# EAGLE design ONA_SensorMoteV1 (EAGLE 6.5.0)

## Sheet 1 of 4
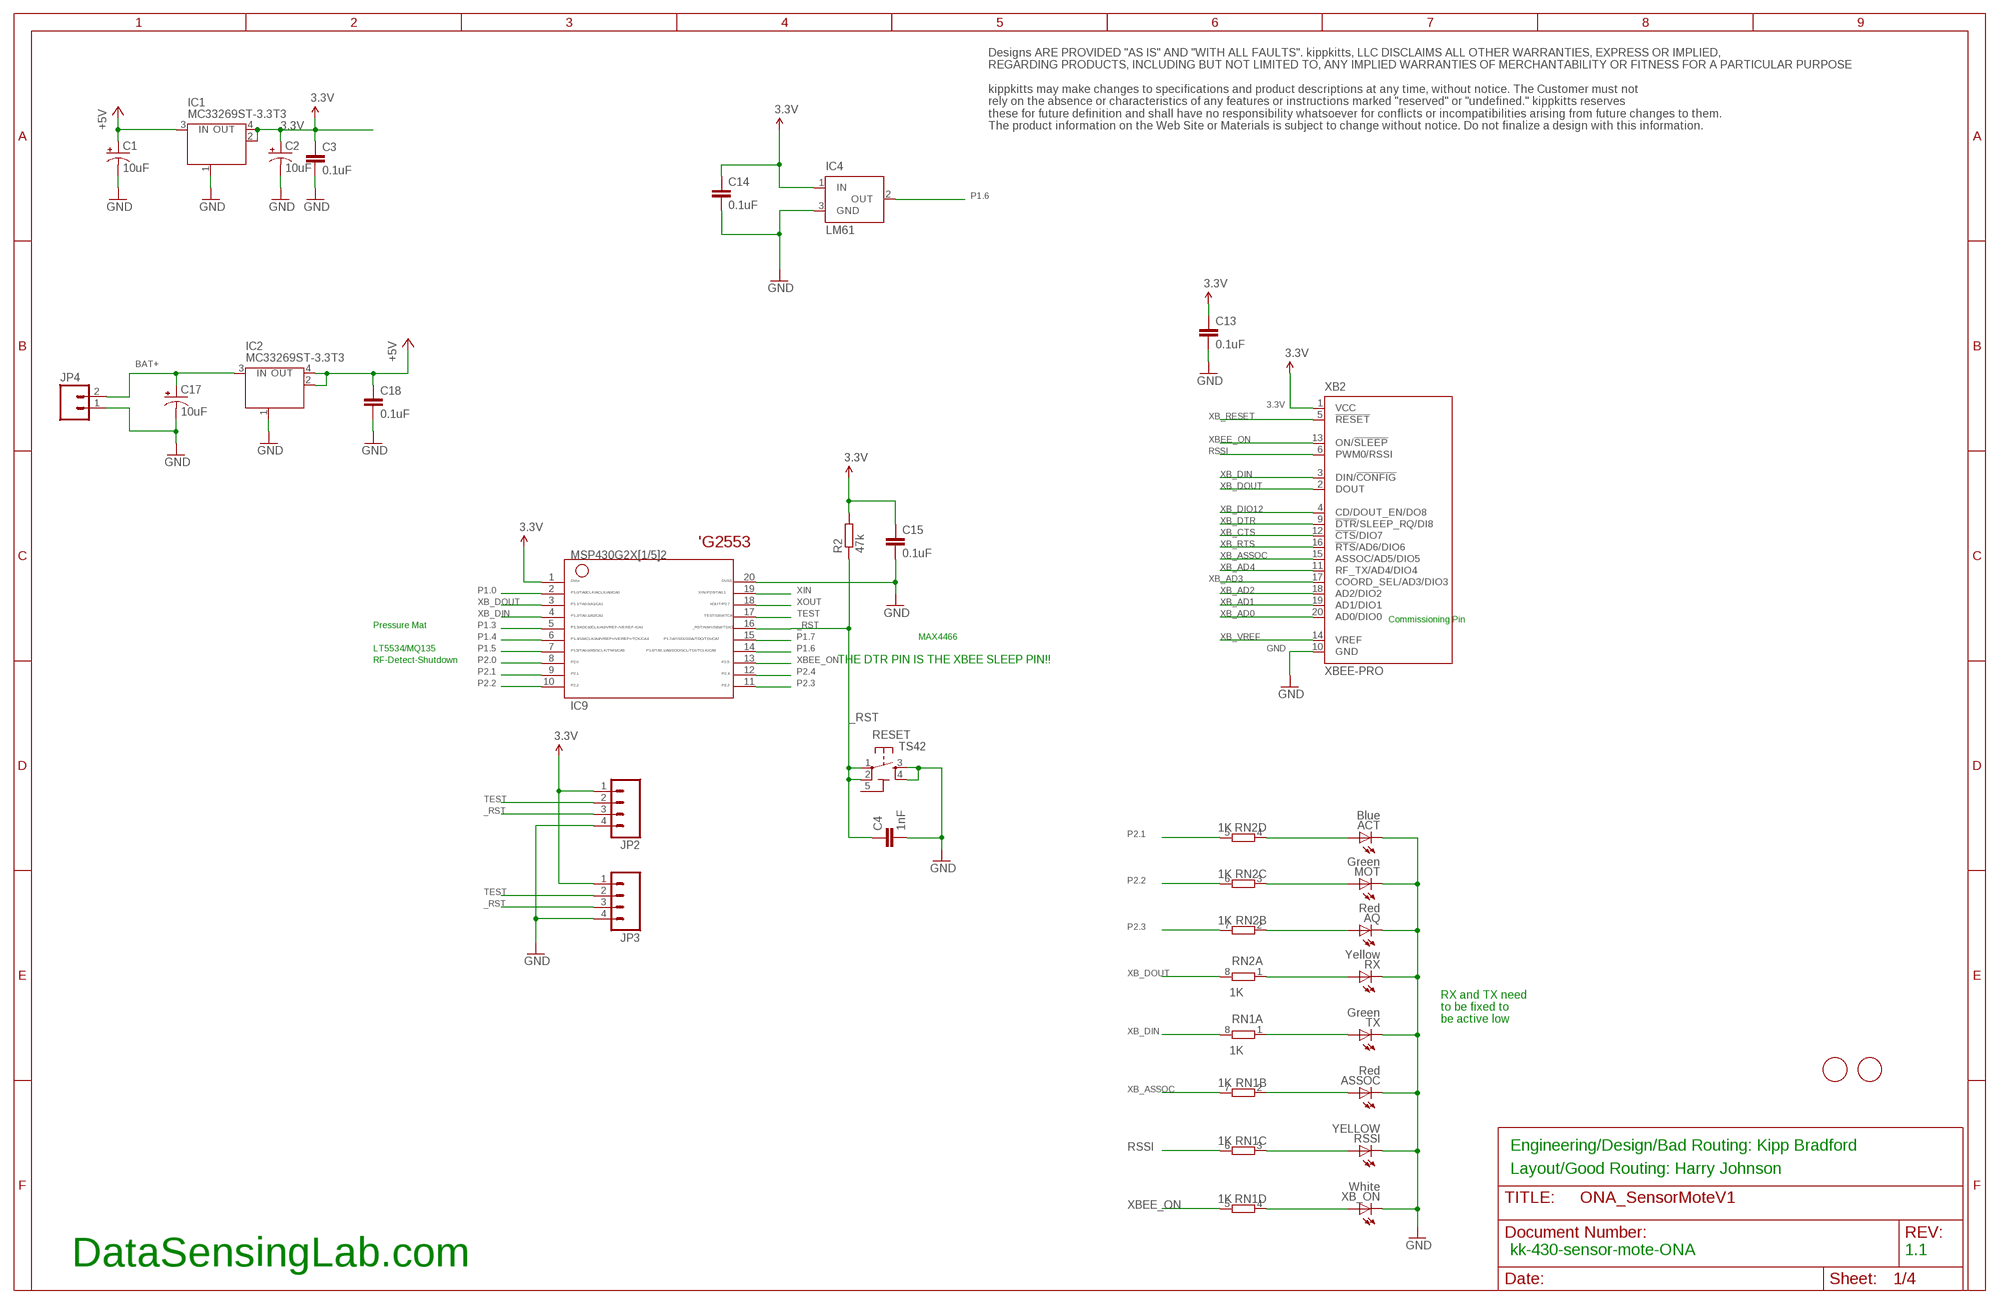
[diagram p0: schematic, sheet 1]

### Parts
A1  FIDUCIALMOUNT  [FIDUCIA-MOUNT]
A2  FIDUCIALMOUNT  [FIDUCIA-MOUNT]
ACT  Blue  LEDCHIP-LED0805  [CHIP-LED0805]
AQ  Red  LEDCHIP-LED0805  [CHIP-LED0805]
ASSOC  Red  LEDCHIP-LED0805  [CHIP-LED0805]
C1  10uF  CAP_POL1206  [EIA3216]
C2  10uF  CAP_POL1206  [EIA3216]
C3  0.1uF  C-EUC0805K  [C0805K]
C4  1nF  C-EUC0805K  [C0805K]
C13  0.1uF  C-EUC0805K  [C0805K]
C14  0.1uF  C-EUC0805K  [C0805K]
C15  0.1uF  C-EUC0805K  [C0805K]
C17  10uF  CAP_POL1206  [EIA3216]
C18  0.1uF  C-EUC0805K  [C0805K]
DISCLAIMER1  DISCLAIMERV1  [DISCLAIMER]
IC1  MC33269ST-3.3T3  [SOT223]
IC2  MC33269ST-3.3T3  [SOT223]
IC4  LM61  MAX6520  [SOT23]
IC9  G2X[1/5]2---PW20  [PW20]
JP2  M04SMD  [1X04-SMD]
JP3  M04PTH  [1X04]
JP4  M02  [1X02_LONGPADS]
MOT  Green  LEDCHIP-LED0805  [CHIP-LED0805]
R2  47k  R-EU_R0805  [R0805]
RESET  TS42  [TS42]
RN1  1K  4R-NCAY16  [CAY16]
RN2  1K  4R-NCAY16  [CAY16]
RSSI  YELLOW  LEDCHIP-LED0805  [CHIP-LED0805]
RX  Yellow  LEDCHIP-LED0805  [CHIP-LED0805]
TX  Green  LEDCHIP-LED0805  [CHIP-LED0805]
XB2  XBEE-PRO  [XBEE-PRO]
XB_ON  White  LEDCHIP-LED0805  [CHIP-LED0805]

### Nets
3.3V: C2.A(+) C3.1 C13.1 C14.1 C15.1 IC1.2(OUT) IC1.4(OUT) IC4.1(IN) IC9.1 JP2.1 JP3.1 R2.2 XB2.1(VCC) ; also sheet 2,3
+5V: C1.A(+) C18.1 IC1.3(IN) IC2.2(OUT) IC2.4(OUT) ; also sheet 3
_RST: C4.1 IC9.16 JP2.3 JP3.3 R2.1 RESET.1 RESET.2
BAT+: C17.A(+) IC2.3(IN) JP4.2
GND: ACT.C AQ.C ASSOC.C C1.C(-) C2.C(-) C3.2 C4.2 C13.2 C14.2 C15.2 C17.C(-) C18.2 IC1.1(GND/ADJ) IC2.1(GND/ADJ) IC4.3(GND) IC9.20 JP2.4 JP3.4 JP4.1 MOT.C RESET.3 RESET.4 RSSI.C RX.C TX.C XB2.10(GND) XB_ON.C ; also sheet 2,3
N$1: RN1.1 TX.A
N$4: ASSOC.A RN1.2
N$11: ACT.A RN2.4
N$15: MOT.A RN2.3
N$16: RN1.3 RSSI.A
N$18: AQ.A RN2.2
N$19: RN2.1 RX.A
N$29: RN1.4 XB_ON.A
P1.0: IC9.2
P1.3: IC9.5 ; also sheet 3
P1.4: IC9.6 ; also sheet 3
P1.5: IC9.7 ; also sheet 3
P1.6: IC4.2(OUT) IC9.14
P1.7: IC9.15 ; also sheet 2
P2.0: IC9.8 ; also sheet 3
P2.1: IC9.9 RN2.5
P2.2: IC9.10 RN2.6
P2.3: IC9.11 RN2.7 ; also sheet 3
P2.4: IC9.12
RSSI: RN1.6 XB2.6(PWM0/RSSI)
TEST: IC9.17 JP2.2 JP3.2
XB_AD0: XB2.20(AD0/DIO0)
XB_AD1: XB2.19(AD1/DIO1)
XB_AD2: XB2.18(AD2/DIO2)
XB_AD3: XB2.17(COORD_SEL/AD3/DIO3)
XB_AD4: XB2.11(RF_TX/AD4/DIO4)
XB_ASSOC: RN1.7 XB2.15(ASSOC/AD5/DIO5)
XB_CTS: XB2.12(!CTS!/DIO7)
XB_DIN: IC9.4 RN1.8 XB2.3(DIN/!CONFIG)
XB_DIO12: XB2.4(CD/DOUT_EN/DO8)
XB_DOUT: IC9.3 RN2.8 XB2.2(DOUT)
XB_DTR: XB2.9(!DTR!/SLEEP_RQ/DI8)
XB_RESET: XB2.5(!RESET)
XB_RTS: XB2.16(!RTS!/AD6/DIO6)
XB_VREF: XB2.14(VREF)
XBEE_ON: IC9.13 RN1.5 XB2.13(ON/!SLEEP)
XIN: IC9.19
XOUT: IC9.18

### Notes on the sheet
- 'G2553
- Commissioning Pin
- Pressure Mat
- MAX4466
- LT5534/MQ135
- RF-Detect-Shutdown | THE DTR PIN IS THE XBEE SLEEP PIN!!
- RX and TX need
  to be fixed to 
  be active low
- Engineering/Design/Bad Routing: Kipp Bradford
- Layout/Good Routing: Harry Johnson
- kk-430-sensor-mote-ONA | 1.1
- DataSensingLab.com

## Sheet 2 of 4: Adafruit Parts
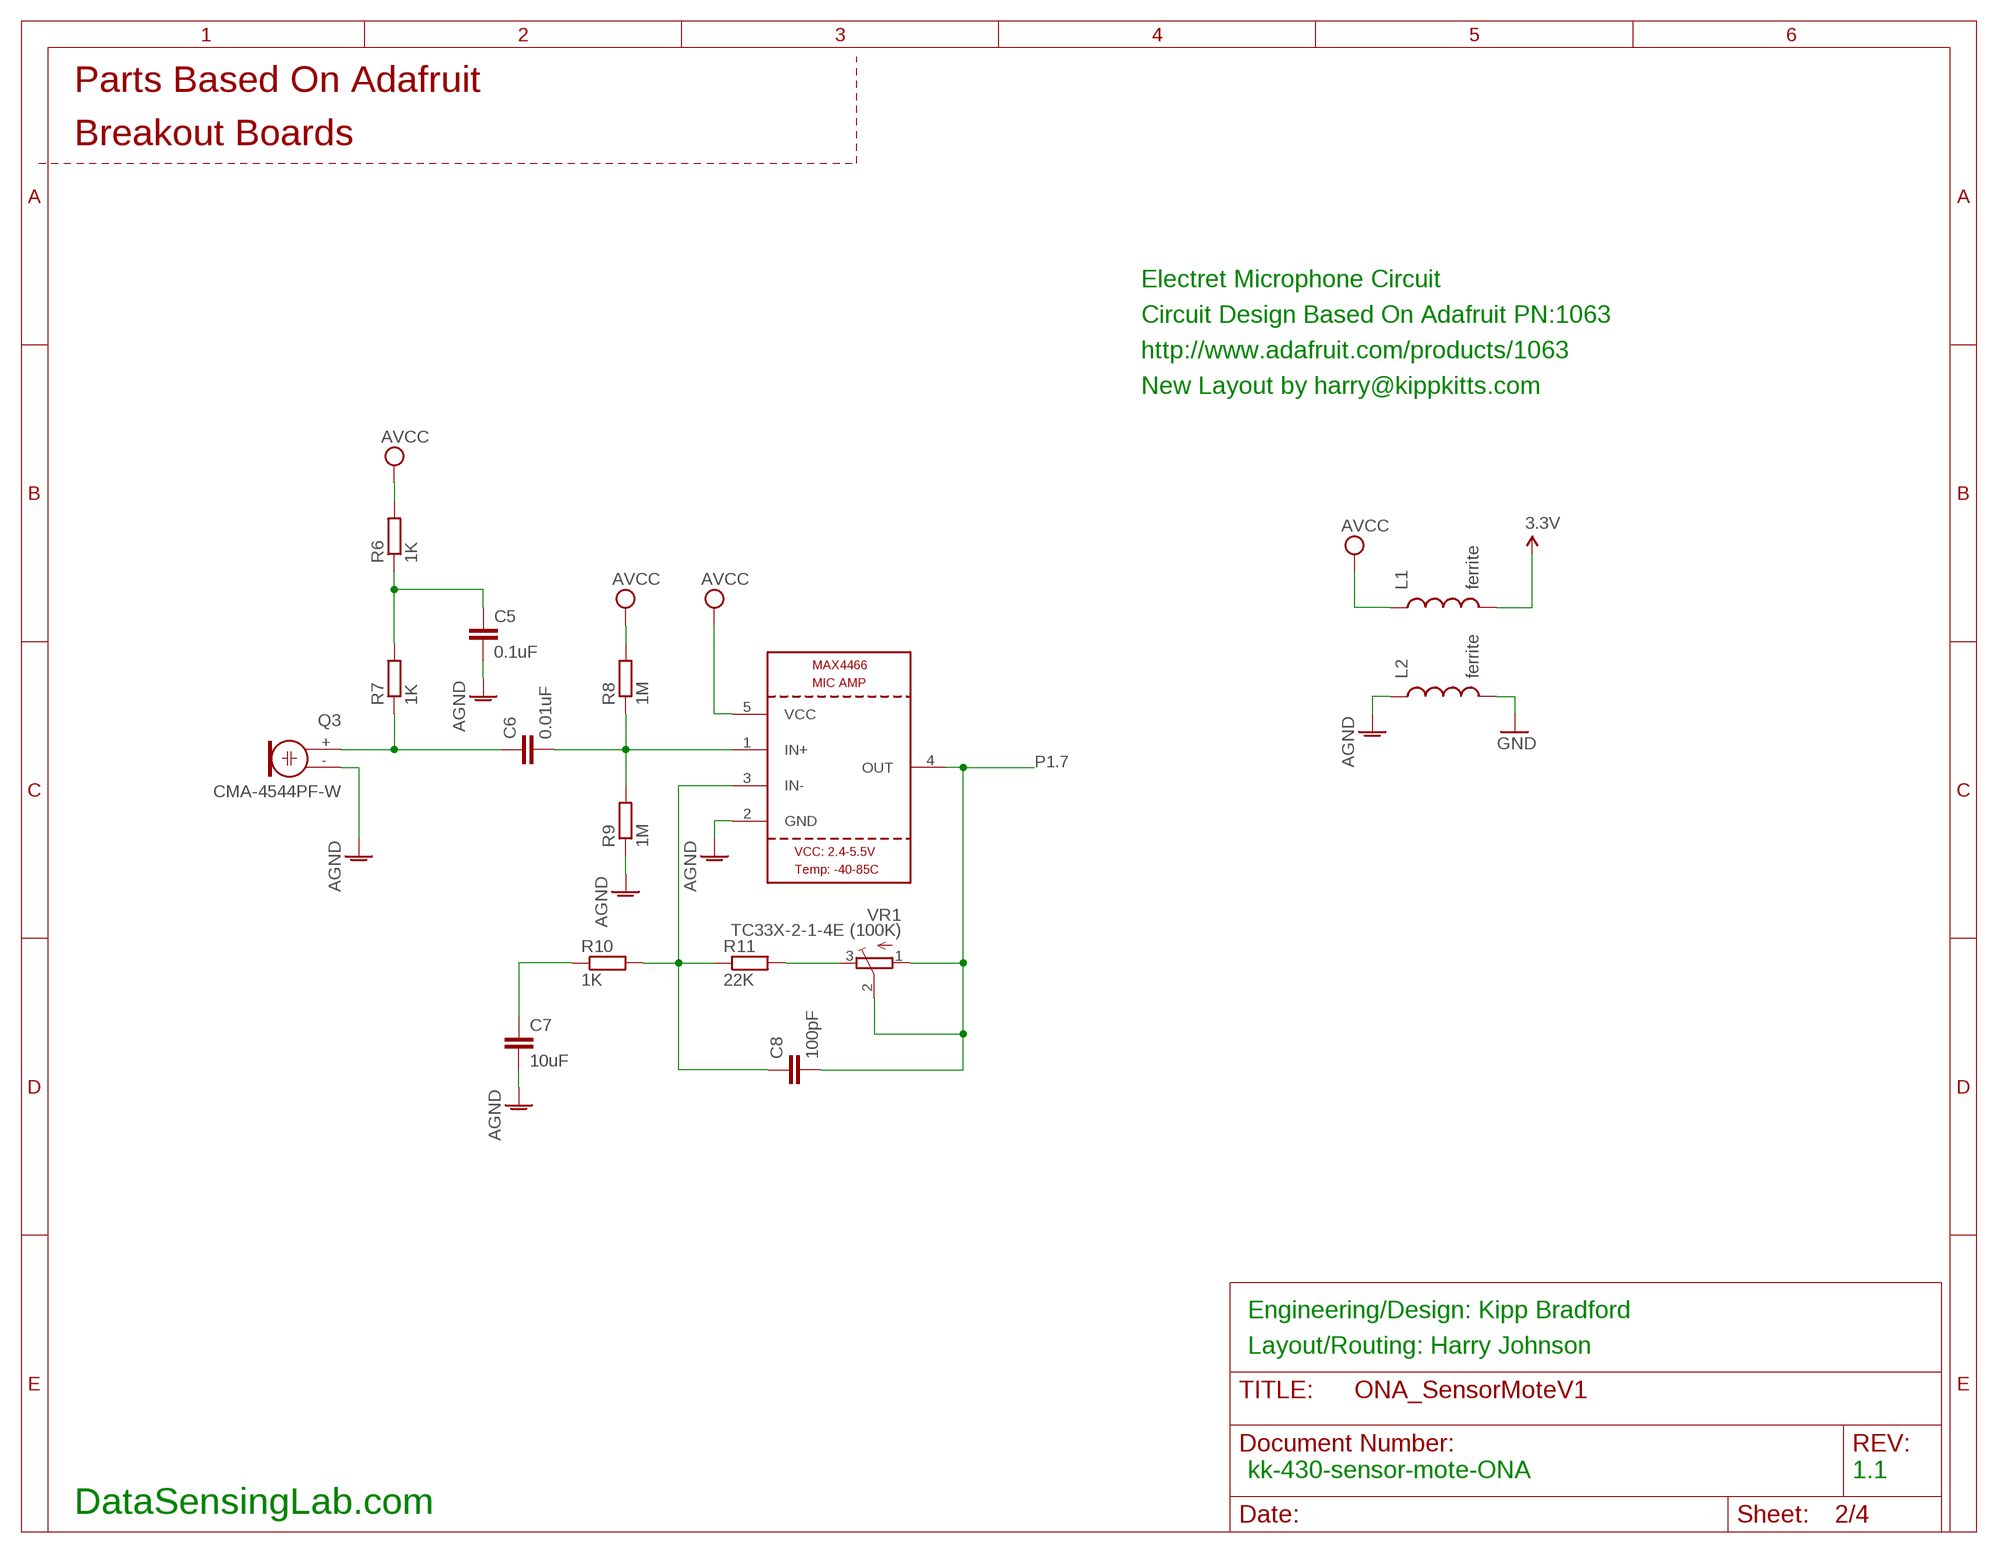
[diagram p1: schematic, sheet 2]

### Parts
C5  0.1uF  C-EUC0805K  [C0805K]
C6  0.01uF  C-EUC0805K  [C0805K]
C7  10uF  C-EUC0805K  [C0805K]
C8  100pF  C-EUC0805K  [C0805K]
L1  ferrite  INDUCTOR0603  [0603]
L2  ferrite  INDUCTOR0603  [0603]
Q3  CMA-4544PF-W  ELECTRET  [9.7ELECTRET]
R6  1K  R-EU_R0805  [R0805]
R7  1K  R-EU_R0805  [R0805]
R8  1M  R-EU_R0805  [R0805]
R9  1M  R-EU_R0805  [R0805]
R10  1K  R-EU_R0805  [R0805]
R11  22K  R-EU_R0805  [R0805]
U5  MAX4466SC70  [SC70-5L]
VR1  TC33X-2-1-4E (100K)  TRIMPOTTC33X  [TC33X]

### Nets
3.3V: L1.2 ; also sheet 1,3
AGND: C5.2 C7.2 L2.1 Q3.- R9.1 U5.2(GND)
GND: L2.2 ; also sheet 1,3
N$2: C6.1 Q3.+ R7.1
N$6: C6.2 R8.1 R9.2 U5.1(IN+)
N$7: C5.1 R6.1 R7.2
N$8: C8.1 R10.2 R11.1 U5.3(IN-)
N$9: C7.1 R10.1
N$10: R11.2 VR1.3(E)
P1.7: C8.2 U5.4(OUT) VR1.1(A) VR1.2(S) ; also sheet 1
VCC: L1.1 R6.2 R8.2 U5.5(VCC) ; supply symbol labelled AVCC

### Notes on the sheet
- Parts Based On Adafruit
- Breakout Boards
- Electret Microphone Circuit
- Circuit Design Based On Adafruit PN:1063
- http://www.adafruit.com/products/1063
- New Layout by harry@kippkitts.com
- Engineering/Design: Kipp Bradford
- Layout/Routing: Harry Johnson
- kk-430-sensor-mote-ONA | 1.1
- DataSensingLab.com

## Sheet 3 of 4: Other_Sensors
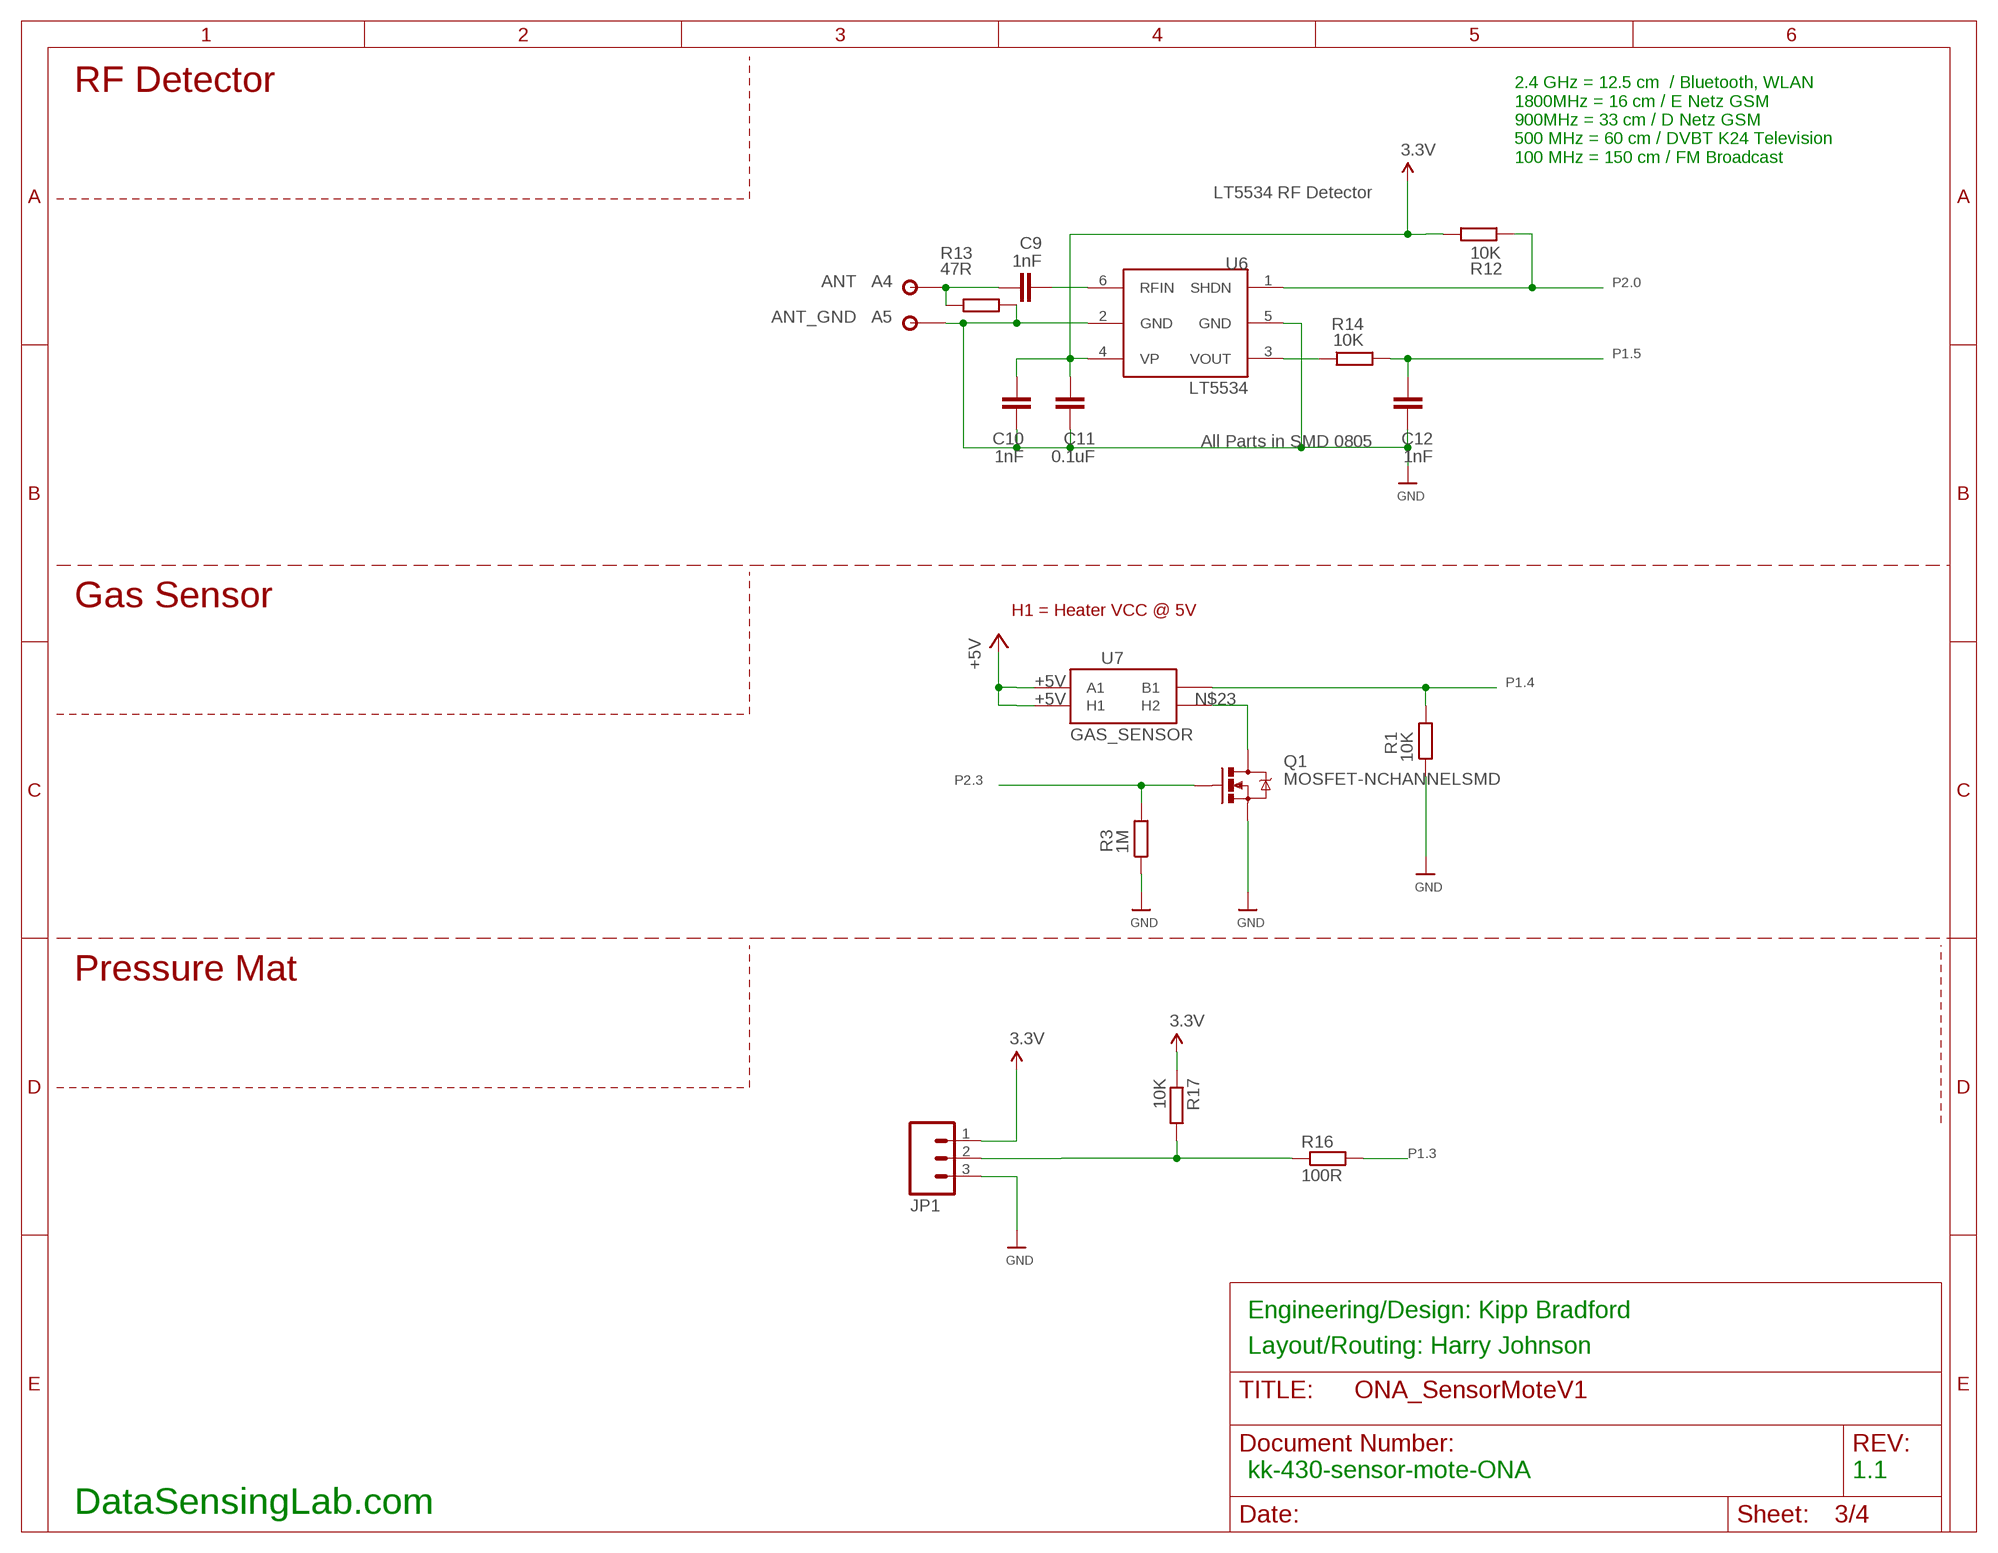
[diagram p2: schematic, sheet 3]

### Parts
A4  ANT  PAD1,46MM  [PAD146]
A5  ANT_GND  PAD1,46MM  [PAD146]
C9  1nF  C-EUC0805K  [C0805K]
C10  1nF  C-EUC0805K  [C0805K]
C11  0.1uF  C-EUC0805K  [C0805K]
C12  1nF  C-EUC0805K  [C0805K]
JP1  M03LOCK  [1X03_LOCK]
Q1  MOSFET-NCHANNELSMD  [SOT23-3]
R1  10K  R-EU_R0805  [R0805]
R3  1M  R-EU_R0805  [R0805]
R12  10K  R-EU_R0805  [R0805]
R13  47R  R-EU_R0805  [R0805]
R14  10K  R-EU_R0805  [R0805]
R16  100R  R-EU_R0805  [R0805]
R17  10K  R-EU_R0805  [R0805]
U6  LT5534  LTC55  [SC70]
U7  GAS_SENSOR  [MQ-3]

### Nets
3.3V: C10.2 C11.2 JP1.1 R12.2 R17.1 U6.4(VP) ; also sheet 1,2
+5V: U7.A1 U7.HA(H1) ; also sheet 1
GND: A5.1 C10.1 C11.1 C12.1 JP1.3 Q1.2(S) R1.1 R3.1 R13.2 U6.2(GND) U6.5(GND) ; also sheet 1,2
N$12: C9.1 U6.6(RFIN)
N$13: A4.1 C9.2 R13.1
N$14: R14.1 U6.3(VOUT)
N$20: JP1.2 R16.1 R17.2
N$23: Q1.3(D) U7.HB(H2)
P1.3: R16.2 ; also sheet 1
P1.4: R1.2 U7.B1 ; also sheet 1
P1.5: C12.2 R14.2 ; also sheet 1
P2.0: R12.1 U6.1(SHDN) ; also sheet 1
P2.3: Q1.1(G) R3.2 ; also sheet 1

### Notes on the sheet
- RF Detector
- 2.4 GHz = 12.5 cm  / Bluetooth, WLAN
  1800MHz = 16 cm / E Netz GSM
  900MHz = 33 cm / D Netz GSM
  500 MHz = 60 cm / DVBT K24 Television
  100 MHz = 150 cm / FM Broadcast
- LT5534 RF Detector
- All Parts in SMD 0805
- Gas Sensor
- H1 = Heater VCC @ 5V
- Pressure Mat
- Engineering/Design: Kipp Bradford
- Layout/Routing: Harry Johnson
- kk-430-sensor-mote-ONA | 1.1
- DataSensingLab.com

## Sheet 4 of 4: Licensce
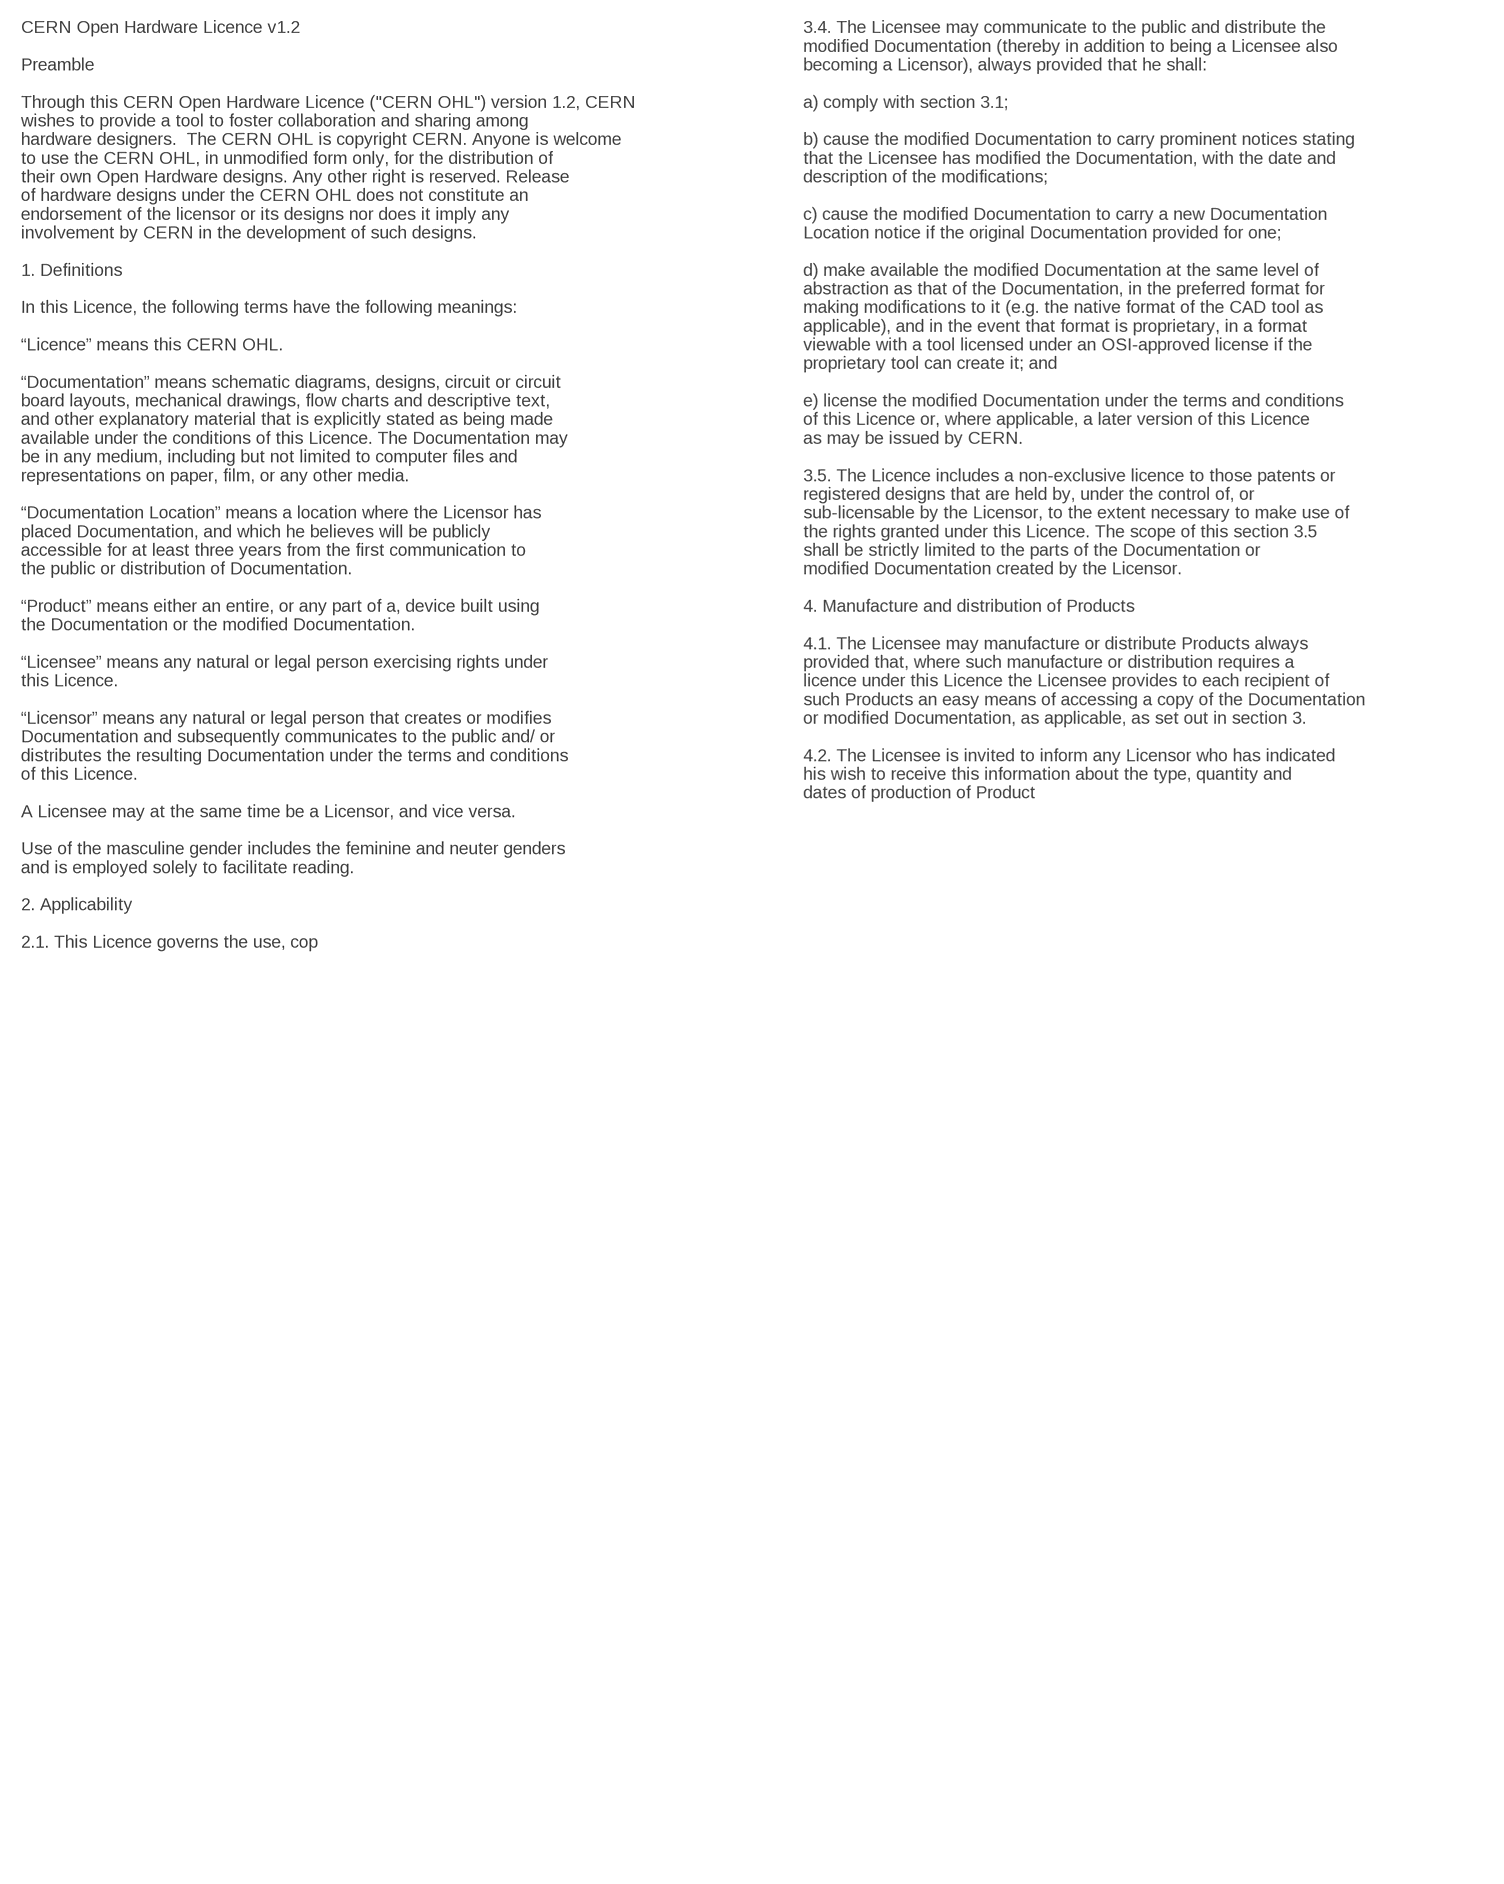
[diagram p3: schematic, sheet 4]

### Notes on the sheet
- CERN Open Hardware Licence v1.2 
  
  Preamble
  
  Through this CERN Open Hardware Licence ("CERN OHL") version 1.2, CERN
  wishes to provide a tool to foster collaboration and sharing among
  hardware designers.  The CERN OHL is copyright CERN. Anyone is welcome
  to use the CERN OHL, in unmodified form only, for the distribution of
  their own Open Hardware designs. Any other right is reserved. Release
  of hardware designs under the CERN OHL does not constitute an
  endorsement of the licensor or its designs nor does it imply any
  involvement by CERN in the development of such designs.
  
  1. Definitions
  
  In this Licence, the following terms have the following meanings:
   
  “Licence” means this CERN OHL.
  
  “Documentation” means schematic diagrams, designs, circuit or circuit
  board layouts, mechanical drawings, flow charts and descriptive text,
  and other explanatory material that is explicitly stated as being made
  available under the conditions of this Licence. The Documentation may
  be in any medium, including but not limited to computer files and
  representations on paper, film, or any other media.
  
  “Documentation Location” means a location where the Licensor has
  placed Documentation, and which he believes will be publicly
  accessible for at least three years from the first communication to
  the public or distribution of Documentation.
  
  “Product” means either an entire, or any part of a, device built using
  the Documentation or the modified Documentation.
  
  “Licensee” means any natural or legal person exercising rights under
  this Licence.
  
  “Licensor” means any natural or legal person that creates or modifies
  Documentation and subsequently communicates to the public and/ or
  distributes the resulting Documentation under the terms and conditions
  of this Licence.
  
  A Licensee may at the same time be a Licensor, and vice versa. 
  
  Use of the masculine gender includes the feminine and neuter genders
  and is employed solely to facilitate reading.
  
  2. Applicability
  
  2.1. This Licence governs the use, copying, modification,
  communication to the public and distribution of the Documentation, and
  the manufacture and distribution of Products. By exercising any right
  granted under this Licence, the Licensee irrevocably accepts these
  terms and conditions.
  
  2.2. This Licence is granted by the Licensor directly to the Licensee,
  and shall apply worldwide and without limitation in time. The Licensee
  may assign his licence rights or grant sub-licences.
  
  2.3. This Licence does not extend to software, firmware, or code
  loaded into programmable devices which may be used in conjunction with
  the Documentation, the modified Documentation or with Products, unless
  such software, firmware, or code is explicitly expressed to be subject
  to this Licence. The use of such software, firmware, or code is
  otherwise subject to the applicable licence terms and conditions.
  
  3. Copying, modification, communication to the public and distribution
  of the Documentation
  
  3.1. The Licensee shall keep intact all copyright and trademarks
  notices, all notices referring to Documentation Location, and all
  notices that refer to this Licence and to the disclaimer of warranties
  that are included in the Documentation. He shall include a copy
  thereof in every copy of the Documentation or, as the case may be,
  modified Documentation, that he communicates to the public or
  distributes.
  
  3.2. The Licensee may copy, communicate to the public and distribute
  verbatim copies of the Documentation, in any medium, subject to the
  requirements specified in section 3.1.
  
  3.3. The Licensee may modify the Documentation or any portion thereof
  provided that upon modification of the Documentation, the Licensee
  shall make the modified Documentation available from a Documentation
  Location such that it can be easily located by an original Licensor
  once the Licensee communicates to the public or distributes the
  modified Documentation under section 3.4, and, where required by
  section 4.1, by a recipient of a Product. However, the Licensor shall
  not assert his rights under the foregoing proviso unless or until a
  Product is distributed.
- 3.4. The Licensee may communicate to the public and distribute the
  modified Documentation (thereby in addition to being a Licensee also
  becoming a Licensor), always provided that he shall:
  
  a) comply with section 3.1;
  
  b) cause the modified Documentation to carry prominent notices stating
  that the Licensee has modified the Documentation, with the date and
  description of the modifications;
  
  c) cause the modified Documentation to carry a new Documentation
  Location notice if the original Documentation provided for one;
  
  d) make available the modified Documentation at the same level of
  abstraction as that of the Documentation, in the preferred format for
  making modifications to it (e.g. the native format of the CAD tool as
  applicable), and in the event that format is proprietary, in a format
  viewable with a tool licensed under an OSI-approved license if the
  proprietary tool can create it; and
  
  e) license the modified Documentation under the terms and conditions
  of this Licence or, where applicable, a later version of this Licence
  as may be issued by CERN.
  
  3.5. The Licence includes a non-exclusive licence to those patents or
  registered designs that are held by, under the control of, or
  sub-licensable by the Licensor, to the extent necessary to make use of
  the rights granted under this Licence. The scope of this section 3.5
  shall be strictly limited to the parts of the Documentation or
  modified Documentation created by the Licensor.
  
  4. Manufacture and distribution of Products
  
  4.1. The Licensee may manufacture or distribute Products always
  provided that, where such manufacture or distribution requires a
  licence under this Licence the Licensee provides to each recipient of
  such Products an easy means of accessing a copy of the Documentation
  or modified Documentation, as applicable, as set out in section 3.
  
  4.2. The Licensee is invited to inform any Licensor who has indicated
  his wish to receive this information about the type, quantity and
  dates of production of Products the Licensee has (had) manufactured
  
  5. Warranty and liability
  
  5.1. DISCLAIMER – The Documentation and any modified Documentation are
  provided "as is" and any express or implied warranties, including, but
  not limited to, implied warranties of merchantability, of satisfactory
  quality, non-infringement of third party rights, and fitness for a
  particular purpose or use are disclaimed in respect of the
  Documentation, the modified Documentation or any Product. The Licensor
  makes no representation that the Documentation, modified
  Documentation, or any Product, does or will not infringe any patent,
  copyright, trade secret or other proprietary right. The entire risk as
  to the use, quality, and performance of a Product shall be with the
  Licensee and not the Licensor. This disclaimer of warranty is an
  essential part of this Licence and a condition for the grant of any
  rights granted under this Licence. The Licensee warrants that it does
  not act in a consumer capacity.
  
  5.2. LIMITATION OF LIABILITY – The Licensor shall have no liability
  for direct, indirect, special, incidental, consequential, exemplary,
  punitive or other damages of any character including, without
  limitation, procurement of substitute goods or services, loss of use,
  data or profits, or business interruption, however caused and on any
  theory of contract, warranty, tort (including negligence), product
  liability or otherwise, arising in any way in relation to the
  Documentation, modified Documentation and/or the use, manufacture or
  distribution of a Product, even if advised of the possibility of such
  damages, and the Licensee shall hold the Licensor(s) free and harmless
  from any liability, costs, damages, fees and expenses, including
  claims by third parties, in relation to such use.
  
  6. General
  
  6.1. Except for the rights explicitly granted hereunder, this Licence
  does not imply or represent any transfer or assignment of intellectual
  property rights to the Licensee.
  
  6.2. The Licensee shall not use or make reference to any of the names
  (including acronyms and abbreviations), images, or logos under which
  the Licensor is known, save in so far as required to comply with
  section 3. Any such permitted use or reference shall be factual and
  shall in no event suggest any kind of endorsement by the Licensor or
  its personnel of the modified Documentation or any Product, or any
  kind of implication by the Licensor or its personnel in the
  preparation of the modified Documentation or Product.
  
  6.3. CERN may publish updated versions of this Licence which retain
  the same general provisions as this version, but differ in detail so
  far this is required and reasonable. New versions will be published
  with a unique version number.
  
  6.4. This Licence shall terminate with immediate effect, upon written
  notice and without involvement of a court if the Licensee fails to
  comply with any of its terms and conditions, or if the Licensee
  initiates legal action against Licensor in relation to this
  Licence. Section 5 shall continue to apply.

## Power pins joined to a net without a drawn wire
5-GND: RESET.5(5-GND)

## Library data of the parts
A1 A2 = Smartprj:FIDUCIALMOUNT
A4 A5 = 1martin:PAD
ACT AQ ASSOC MOT RSSI RX TX XB_ON = led:LED: LED OSRAM: - CHIPLED LG R971, LG N971, LY N971, LG Q971, LY Q971, LO R971, LY R971 LH N974, LH R974 LS Q976, LO Q976, LY Q976 LO Q996 - Hyper CHIPLED LW Q18S LB Q993, LB Q99A, LB R99A - SideLED LS A670, LO A670, LY A670, LG A670, LP A670 LB A673, LV A673, LT A673, LW A673 LH A674 LY A675 LS A676, LA A676, LO A676, LY A676, LW A676 LS A679, LY A679, LG A679 - Hyper Micro SIDELED® LS Y876, LA Y876, LO Y876, LY Y876 LT Y87S - SmartLED LW L88C, LW L88S LB L89C, LB L89S, LG L890 LS L89K, LO L89K, LY L89K LS L896, LA L896, LO L896, LY L896 - TOPLED LS T670, LO T670, LY T670, LG T670, LP T670 LSG T670, LSP T670, LSY T670, LOP T670, LYG T670 LG T671, LOG T671, LSG T671 LB T673, LV T673, LT T673, LW T673 LH T674 LS T676, LA T676, LO T676, LY T676, LB T676, LH T676, LSB T676, LW T676 LB T67C, LV T67C, LT T67C, LS T67K, LO T67K, LY T67K, LW E67C LS E67B, LA E67B, LO E67B, LY E67B, LB E67C, LV E67C, LT E67C LW T67C LS T679, LY T679, LG T679 LS T770, LO T770, LY T770, LG T770, LP T770 LB T773, LV T773, LT T773, LW T773 LH T774 LS E675, LA E675, LY E675, LS T675 LS T776, LA T776, LO T776, LY T776, LB T776 LHGB T686 LT T68C, LB T68C - Hyper Mini TOPLED® LB M676 - Mini TOPLED Santana® LG M470 LS M47K, LO M47K, LY M47K Source: http://www.osram.convergy.de LUXEON: - LUMILED® LXK2-PW12-R00, LXK2-PW12-S00, LXK2-PW14-U00, LXK2-PW14-V00 LXK2-PM12-R00, LXK2-PM12-S00, LXK2-PM14-U00 LXK2-PE12-Q00, LXK2-PE12-R00, LXK2-PE12-S00, LXK2-PE14-T00, LXK2-PE14-U00 LXK2-PB12-K00, LXK2-PB12-L00, LXK2-PB12-M00, LXK2-PB14-N00, LXK2-PB14-P00, LXK2-PB14-Q00 LXK2-PR12-L00, LXK2-PR12-M00, LXK2-PR14-Q00, LXK2-PR14-R00 LXK2-PD12-Q00, LXK2-PD12-R00, LXK2-PD12-S00 LXK2-PH12-R00, LXK2-PH12-S00 LXK2-PL12-P00, LXK2-PL12-Q00, LXK2-PL12-R00 Source: www.luxeon.com KINGBRIGHT: KA-3528ASYC Source: www.kingbright.com
C1 C2 C17 = SparkFun:CAP_POL: Capacitor Polarized These are standard SMD and PTH capacitors. Normally 10uF, 47uF, and 100uF in electrolytic and tantalum varieties. Always verify the external diameter of the through hole cap, it varies with capacity, voltage, and manufacturer. The EIA devices should be standard.
C3-C15 C18 = rcl:C-EU: CAPACITOR, European symbol
DISCLAIMER1 = KippKitts:DISCLAIMER
IC1 IC2 = linear:MC33269ST*: Adjustable Output Low Dropout Voltage Regulator 800 mA Source: http://www.onsemi.com/pub/Collateral/MC33269-D.PDF
IC4 = maxim:MAX6520: 1.2V Voltage Reference 50ppm/°C, SOT23, 3-Terminal Source: Data sheet <http://datasheets.maxim-ic.com/en/ds/MAX6520.pdf>; MF: MAXIM; MPN: MAX6520EUR-T; OC_FARNELL: unknown; OC_NEWARK: 02J4586
IC9 = TI_MSP430_v16:G2X[1/5]2---PW20: MSP430G2X[1/5]2 MSP430G2x52, MSP430G2x12 TSSOP (PW) 20 Pin Package http://focus.ti.com/docs/prod/folders/print/msp430g2452.html
JP1 = SparkFun:M03: Header 3 Standard 3-pin 0.1" header. Use with straight break away headers (SKU : PRT-00116), right angle break away headers (PRT-00553), swiss pins (PRT-00743), machine pins (PRT-00117), and female headers (PRT-00115). Molex polarized connector foot print use with SKU : PRT-08232 with associated crimp pins and housings.
JP2 JP3 = SparkFun:M04: Header 4 Standard 4-pin 0.1" header. Use with straight break away headers (SKU : PRT-00116), right angle break away headers (PRT-00553), swiss pins (PRT-00743), machine pins (PRT-00117), and female headers (PRT-00115). Molex polarized connector foot print use with SKU : PRT-08231 with associated crimp pins and housings.
JP4 = SparkFun:M02: Header 2 Standard 2-pin 0.1" header. Use with straight break away headers (SKU : PRT-00116), right angle break away headers (PRT-00553), swiss pins (PRT-00743), machine pins (PRT-00117), and female headers (PRT-00115). Molex polarized connector foot print use with SKU : PRT-08233 with associated crimp pins and housings.
L1 L2 = SparkFun:INDUCTOR: Inductors Basic Inductor/Choke - 0603 and 1206. Footprints are not proven and vary greatly between part numbers.
Q1 = SparkFun:MOSFET-NCHANNEL
Q3 = adafruit:ELECTRET: Electret microphone Thru hole 2.54mm spacing with 9.7mm diameter
R1 R3 R12-R14 R16 R17 = rcl:R-EU_: RESISTOR, European symbol
R2 R6-R11 = resistor:R-EU_: RESISTOR, European symbol
RESET = st-mod v1.4:TS42: TS42 Dongnan Electronics Tact switch VDC 12V - 50mA
RN1 RN2 = resistor-dil:4R-N: Array Chip Resistor Source: RS Component / Phycomp; OC_FARNELL: unknown; OC_NEWARK: unknown
U5 = KippKitts:MAX4466: MAX4466 Mic Amp
U6 = 1martin:LTC55
U7 = SparkFun:GAS_SENSOR: MQ-3 Gas Sensor. FP not tested. Part#
VR1 = adafruit:TRIMPOT: SMT trimmer potentiometer part number TC33X http://www.ladyada.net/library/eagle
XB2 = maxstream:XBEE: XBee (TM) /XBee-PRO(TM) OEM RF Modules Source: MaxStream, Inc. xbee_productmanual.pdf; MPN: XBP24-AWI-001; OC_FARNELL: 1337916; OC_NEWARK: 42M2667

## Net classes
0 default: width 0.203 mm, drill 0.305 mm, clearance 0.203 mm
2 gnd: width 0.203 mm, drill 0.305 mm, clearance 0.203 mm

## Board
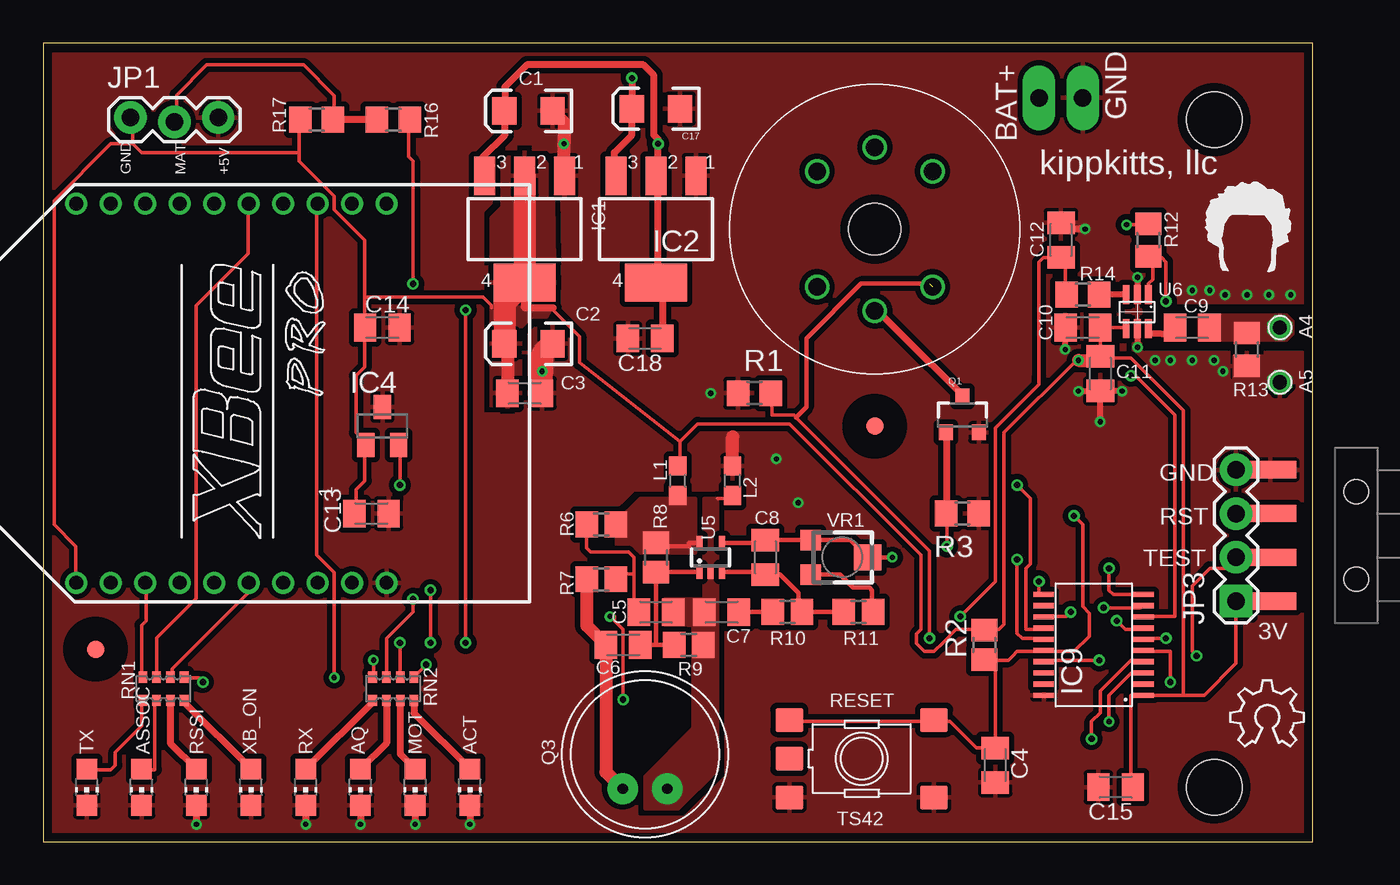
[diagram p4: board, top side]
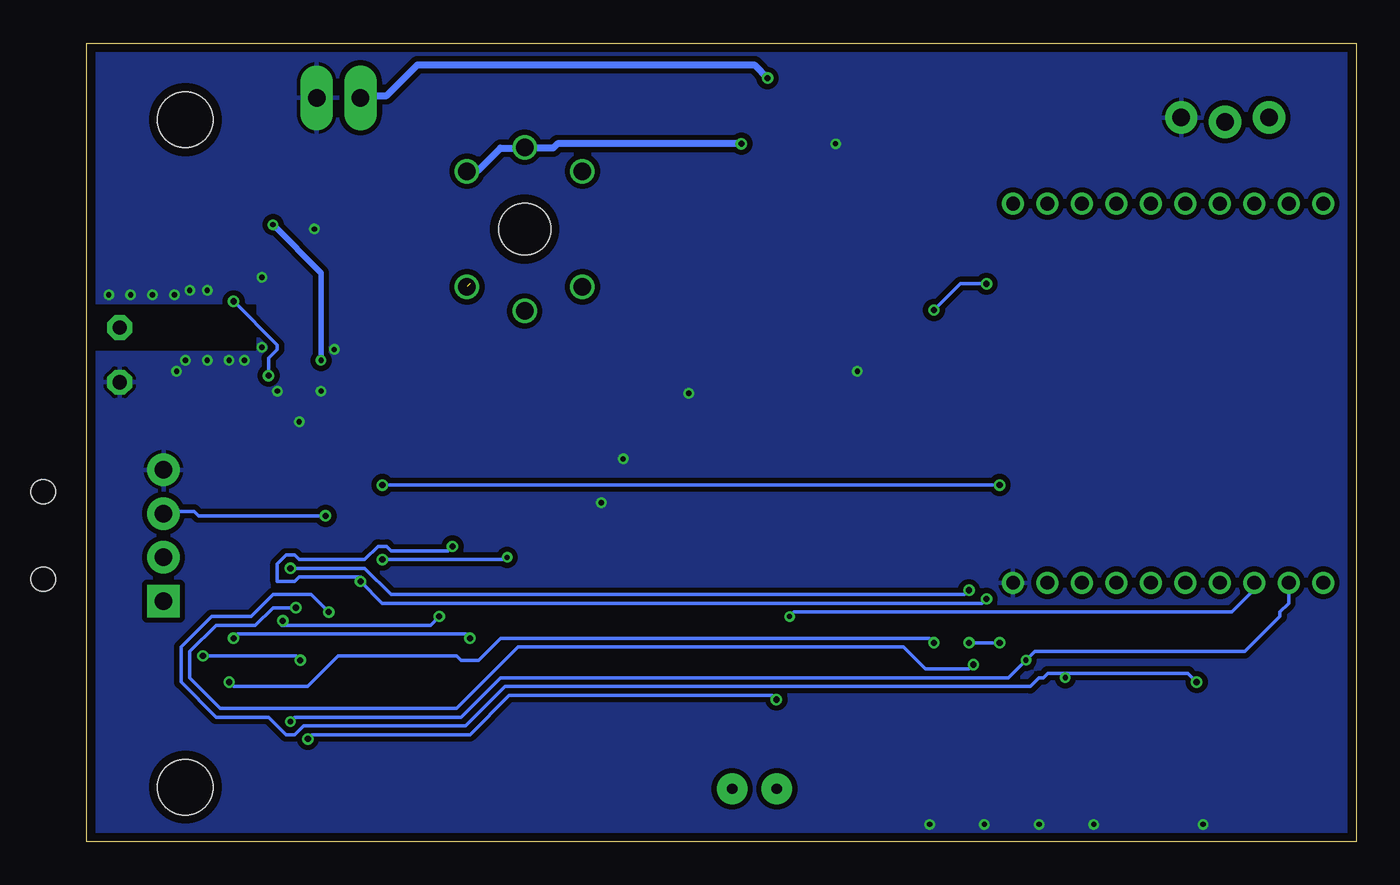
[diagram p5: board, bottom side, seen from below]

Size 73.66 x 46.35 mm. Coordinates in mm from the lower left corner, seen from the top.
Outline: 0,0 73.66,0 73.66,46.35 0,46.35 0,0
Copper layers (1*16): Top 0.035mm / dielectric 1.5mm / Bottom 0.035mm
Design rules "PCB-POOL": minimum track width 6mil, minimum drill 12mil, track to track 6mil, track to pad 6mil, pad to pad 6mil, via to via 6mil, smd to smd 6mil, copper to edge 20mil, drill to drill 8mil, minimum pad ring 8mil, minimum via ring 6mil, stop-mask expansion 3mil, vias tented up to drill 0mil, thermal gap 8mil
Holes 3.2 mm at 67.95,41.91 67.95,3.17

### Footprints (pad centres in the part's own frame; a part is rotated, then mirrored left to right if it is on the bottom)
FIDUCIA-MOUNT = smd 1.016 x 1.016: P$1 0,0
PAD146 = drill 0.813 pad 1.422 octagon: 1 0,0
CHIP-LED0805 = smd 1.2 x 1.2: A 0,-1.05; C 0,1.05
EIA3216 = smd 1.4 x 1.6: A 1.4,0; C -1.4,0
C0805K = smd 1.3 x 1.6: 1 -1,0; 2 1,0
SOT223 = smd 1.219 x 2.235: 1 -2.311,-3.099; 2 0,-3.099; 3 2.311,-3.099 | smd 3.6 x 2.2: 4 0,3.099
SOT23 = smd 1 x 1.4: 1 -0.95,-1.1; 2 0.95,-1.1; 3 0,1.1
PW20 = smd 0.3 x 1.2: 1 -2.925,-2.9; 2 -2.275,-2.9; 3 -1.625,-2.9; 4 -0.975,-2.9; 5 -0.325,-2.9; 6 0.325,-2.9; 7 0.975,-2.9; 8 1.625,-2.9; 9 2.275,-2.9; 10 2.925,-2.9; 11 2.925,2.9; 12 2.275,2.9; 13 1.625,2.9; 14 0.975,2.9; 15 0.325,2.9; 16 -0.325,2.9; 17 -0.975,2.9; 18 -1.625,2.9; 19 -2.275,2.9; 20 -2.925,2.9
1X03_LOCK = drill 1.016 pad 1.88: 1 0,0.127; 2 2.54,-0.127; 3 5.08,0.127
1X04-SMD = smd 1 x 3: 1 -3.81,5; 2 -1.27,5; 3 1.27,5; 4 3.81,5 | hole 1.4: -2.54,0; 2.54,0
1X04 = drill 1.016 pad 1.88 square: 1 0,0 | drill 1.016 pad 1.88: 2 2.54,0; 3 5.08,0; 4 7.62,0
1X02_LONGPADS = drill 1.016 pad 1.88 long: 1 0,0; 2 2.54,0
0603 = smd 1.1 x 1: 1 -0.85,0; 2 0.85,0
SOT23-3 = smd 0.8 x 0.9: 1 -0.95,-1; 2 0.95,-1; 3 0,1.1
9.7ELECTRET = drill 0.6 pad 1.778: + 1.3,2; - -1.3,2
R0805 = smd 1.3 x 1.5: 1 -0.95,0; 2 0.95,0
R0805' = smd 1.3 x 1.5: 1 -0.85,0; 2 0.85,0
TS42 = smd 1.6 x 1.4: 1 -4.2,2.25; 2 4.2,2.25; 3 -4.2,-2.25; 4 4.2,-2.25; 5 -4.2,0
CAY16 = smd 0.5 x 0.65: 1 -1.2,-0.675; 2 -0.4,-0.675; 3 0.4,-0.675; 4 1.2,-0.675; 5 1.2,0.675; 6 0.4,0.675; 7 -0.4,0.675; 8 -1.2,0.675
SC70-5L = smd 0.35 x 0.8: 1 -0.65,-0.85; 2 0,-0.85; 3 0.65,-0.85; 4 0.65,0.85; 5 -0.65,0.85
SC70 = smd 0.4 x 1.1: 1 0,0; 2 0.65,0; 3 1.3,0; 4 1.3,1.95; 5 0.65,1.95; 6 0,1.95
MQ-3 = drill 1.016: A1 -3.35,3.35; A2 -3.35,-3.35; B1 3.35,3.35; B2 3.35,-3.35; HA -4.75,0; HB 4.75,0 | hole 3: 0,0
TC33X = smd 1.2 x 1.2: 1 -1,-1.825; 3 1,-1.825 | smd 1.5 x 1.6: 2 0,1.5
XBEE-PRO = drill 0.8 pad 1.27: 1 -11,9; 2 -11,7; 3 -11,5; 4 -11,3; 5 -11,1; 6 -11,-1; 7 -11,-3; 8 -11,-5; 9 -11,-7; 10 -11,-9; 11 11,-9; 12 11,-7; 13 11,-5; 14 11,-3; 15 11,-1; 16 11,1; 17 11,3; 18 11,5; 19 11,7; 20 11,9

### Placement (x,y rotation side)
A1  3.05,11.18 0 top
A2  48.26,24.13 0 top
A4  71.76,29.85 90 top
A5  71.76,26.67 90 top
ACT  24.77,3.17 180 top
AQ  18.42,3.17 180 top
ASSOC  5.71,3.17 180 top
C1  28.17,42.42 180 top
C2  28.17,28.91 180 top
C3  27.94,26.04 0 top
C4  55.24,4.45 270 top
C5  35.56,13.33 0 top
C6  33.66,11.43 0 top
C7  39.37,13.33 180 top
C8  41.91,16.51 90 top
C9  66.68,29.85 0 top
C10  60.32,29.85 0 top
C11  61.34,27.18 90 top
C12  59.05,34.92 270 top
C13  19.05,19.05 0 top
C14  19.69,29.85 0 top
C15  62.23,3.17 180 top
C17  35.56,42.54 180 top
C18  34.92,29.21 180 top
DISCLAIMER1  -4.13,-16.19 0 top  (outside the outline)
IC1  27.94,35.56 180 top
IC2  35.56,35.56 180 top
IC4  19.69,24.13 0 top
IC9  60.96,11.43 90 top
JP1  5.08,41.91 0 top
JP2  76.2,17.78 90 top
JP3  69.22,13.97 90 top
JP4  60.32,43.18 180 top
L1  36.83,20.96 90 top
L2  40,20.96 90 top
MOT  21.59,3.17 180 top
Q1  53.34,24.77 0 top
Q3  34.92,5.08 180 top
R1  41.27,26.04 0 top
R2  47k  [R0805']  54.61,11.43 90 top
R3  53.34,19.05 180 top
R6  1K  [R0805']  32.38,18.42 0 top
R7  1K  [R0805']  32.38,15.24 0 top
R8  1M  [R0805']  35.56,16.51 90 top
R9  1M  [R0805']  37.46,11.43 180 top
R10  1K  [R0805']  43.18,13.33 0 top
R11  22K  [R0805']  47.31,13.33 0 top
R12  64.14,34.92 90 top
R13  69.85,28.58 270 top
R14  60.32,31.75 180 top
R16  20.32,41.91 0 top
R17  15.88,41.91 0 top
RESET  47.5,4.83 0 top
RN1  6.98,8.89 0 top
RN2  20.32,8.89 0 top
RSSI  8.89,3.17 180 top
RX  15.24,3.17 180 top
TX  2.54,3.17 180 top
U5  38.73,16.51 0 top
U6  64.14,31.75 180 top
U7  48.26,35.56 270 top
U$3  [OSHW_6X150_NOTEXT]  68.9,5.56 0 top
U$5  [TOP_DOCU_5MM]  66.68,32.38 0 top
VR1  46.35,16.51 270 top
XB2  10.92,26.04 90 top
XB_ON  12.06,3.17 180 top

### Tracks (layer width: path | path; a pad name or v marks a point on that pad's centre or on a via)
3.3V  (via drill 0.3)
  Top 0.203: v62.86,35.81 64.07,35.81 R12.2 | C15.1 63.12,3.17 63.12,8.51 63.63,8.51 IC9.1 63.88,8.51 66.17,8.51 | JP2.1 70.99,14.1 69.22,14.1 JP3.1 69.22,13.84 69.22,10.35 67.37,8.51 66.17,8.51 | 61.34,29.85 62.86,29.85 U6.4 | 61.34,29.85 C10.2 61.34,29.85 | 61.34,29.85 61.34,28.32 C11.2 61.59,28.07 63.12,28.07 66.17,25.02 66.17,8.51 | 5.21,40.51 3.94,40.51 0.64,37.21 0.64,18.42 1.91,17.15 1.91,15.11 XB2.1 | 5.21,40.51 5.21,42.04 JP1.1 | 36.96,23.24 36.96,21.97 L1.2 | 36.96,23.24 31.12,27.81 31.12,29.34 29.59,30.86 29.59,30.98 | C13.1 18.16,19.18 18.16,20.45 18.67,20.96 18.67,22.99 IC4.1 18.67,23.24 18.16,23.75 18.16,27.05 18.67,27.56 18.67,29.85 | 14.86,40 14.86,39.5 16.89,37.46 16.89,36.7 18.67,34.92 18.67,31.62 | 14.86,40 14.86,41.78 R17.1 | 18.67,29.85 18.67,31.62 | 18.67,29.85 C14.1 18.67,29.85 | 18.67,31.62 25.53,31.62 26.04,31.12 26.04,31 | 5.21,40.51 5.71,40 14.86,40 | 36.96,23.24 37.97,24.26 43.31,24.26 50.93,16.64 50.93,12.32 50.67,12.06 50.67,11.53 51.15,11.05 51.69,11.05 52.2,11.56 52.96,12.32 54.48,12.32 R2.2 54.74,12.32 55.46,12.32 55.75,12.61 55.75,23.75 59.94,27.94
  Top 0.254: 59.94,27.94 v60.07,27.94
  Top 0.406: 29.59,30.98 27.94,30.98 IC1.4
  Top 0.762: C2.A 26.94,28.74 C3.1 | v60.07,27.94 61.1,27.94 C11.2
  Top 1.27: C2.A 26.77,31.29 IC1.4 IC1.2
  Bottom 0.305: v62.86,35.81 60.07,33.02 v60.07,27.94
  pour Top (isolate 0.305): 29.65,33.53 29.65,31.24 29.21,30.48 28.32,30.48 27.69,29.85 27.69,25.27 26.04,25.27 26.04,36.2 26.67,36.83 26.67,39.37 27.31,40 28.58,40 29.21,39.37 29.21,37.59 29.59,37.21
+5V  (via drill 0.36)
  Top 0.203: 25.53,39.75 25.53,38.99 IC1.3 | 26.8,42.29 C1.A 26.8,42.54 | 35.69,38.48 IC2.2 35.69,38.73 | 35.69,32.64 IC2.4 35.69,32.64 | 35.69,32.64 35.94,32.38 | 35.94,29.34 C18.1
  Top 0.406: 26.8,42.29 26.8,41.02 25.53,39.75 | 35.69,32.64 35.69,38.48 | 35.94,32.38 35.94,29.34 | 26.8,42.54 26.8,43.81 28.07,45.09 34.83,45.09 35.43,44.49 35.43,41.02 35.69,40.77 v35.69,40.51 35.69,38.73
  Top 0.762: 25.4,38.43 IC1.3
  Bottom 0.203: 48.39,40.26 U7.HA 48.13,40.26 | 51.43,38.99 U7.A1
  Bottom 0.406: 48.39,40.26 49.66,40.26 50.93,38.99 51.43,38.99 | 48.13,40.26 46.61,40.26 46.35,40.51 v35.69,40.51
  pour Top (isolate 0.305, no thermals): 60.58,30.61 62.99,30.61 62.99,28.45 62.1,27.56 60.58,27.56
_RST  (via drill 0.36)
  Top 0.203: RESET.1 43.31,6.98 51.69,6.98 RESET.2 51.94,6.98 52.62,6.98 53.21,6.39 54.15,5.46 55.24,5.46 | JP2.3 70.99,19.18 69.22,19.18 JP3.3 | 55.24,10.54 54.74,10.54 R2.1 55.24,10.54 | 55.24,10.54 56.01,10.54 56.26,10.79 56.52,11.05 58.04,11.05 IC9.16 58.29,11.05 59.82,11.05 60.71,11.94 60.71,13.27 60.32,13.65 60.32,18.42 60.01,18.73 60.07,18.67 v59.82,18.92 | 55.24,10.54 55.24,5.46 | 55.24,5.46 C4.1 55.24,5.46
  Bottom 0.203: v59.82,18.92 67.18,18.92 67.44,19.18 69.22,19.18 JP3.3
AGND
  Top 0.203: L2.1 40,19.94 39.24,19.94 39.12,19.94
  pour Top (isolate 0.305, no thermals): 39.12,19.94 39.12,4.15 36.87,1.91 34.92,1.91 34.92,3.81 37.72,6.6 37.72,12.57 35.94,12.57 35.94,14.1 38.35,14.1 38.35,19.94
BAT+  (via drill 0.36)
  Top 0.203: 33.15,38.73 IC2.3 | C17.A
  Top 0.406: 33.15,38.73 33.15,40 34.16,41.02 C17.A v34.16,44.32
  Bottom 0.203: 57.78,43.31 JP4.2
  Bottom 0.406: v34.16,44.32 34.92,45.09 54.48,45.09 56.26,43.31 57.78,43.31
GND  (via drill 0.3)
  Top 0.203: 71.08,21.71 70.99,21.72 JP2.4
  Top 0.254: 59,35.88 C12.1
  Top 0.356: U6.5 63.48,28.72 v63.5,28.7 | v63.5,32.77 63.5,31.77 U6.2 | C11.1 62.59,26.18 v62.61,26.16 | v61.34,24.38 61.34,25.65 60.83,26.16 v60.07,26.16 | v59.31,28.58 59.31,29.83 C10.1
  Top 0.406: RSSI.C v8.89,1.02 | v60.45,35.56 59.17,35.56 C12.1 | RX.C v15.24,1.02 | AQ.C v18.42,1.02 | MOT.C v21.59,1.02 | ACT.C v24.77,1.02
  Top 0.762: C1.C 30.23,41.76 v30.23,40.51 30.23,38.68 IC1.1 | L2.2 40,23.5
  Top 1.27: C2.C 28.96,28.3 v28.96,27.31 28.96,26.05 C3.2
  other vias: 64.52,27.94 65.41,27.94 66.68,27.94 67.95,27.94 68.45,27.31 68.58,31.75 69.85,31.75 71.12,31.75 72.39,31.75 66.68,32 67.69,32 38.73,26.04 42.54,22.23 43.81,19.69
  pour Bottom (isolate 0.305): 0,47.62 74.93,47.62 74.93,-0.64 0,-0.64
  pour Top (isolate 0.305, no thermals): 69.09,28.19 72.14,28.19 72.64,27.69 72.64,26.92 72.14,26.42 69.09,26.42
  pour Top (isolate 0.305, rank 2): -0.64,45.72 76.84,45.72 76.84,-0.64 -0.64,-0.64
N$1
  Top 0.203: RN1.1 5.71,8 5.71,6.73 4.19,5.21 4.19,4.45 3.94,4.19 2.67,4.19 TX.A
N$2
  Top 0.762: R7.1 31.54,12.55 C6.1 32.66,4.05 Q3.+
N$4
  Top 0.203: RN1.2 6.48,8 6.48,4.19 5.71,4.19 ASSOC.A
N$6
  Top 0.254: 35.56,11.43 R8.1 36.01,15.66 U5.1 | 35.56,11.43 R9.2 | C6.2 35.56,11.43
N$7
  Top 0.203: R6.1 31.54,17.04 31.75,16.83 33.97,16.83 34.29,16.51 34.29,15.56 | 34.29,15.56 34.29,13.61 C5.1 | R7.2 33.55,15.56 34.29,15.56
N$8
  Top 0.254: R10.2 44.03,13.5 | R10.2 R11.1 | U5.3 41.61,15.66 C8.1 42.02,15.51 42.75,15.51 43.81,14.45 43.81,13.55 R10.2
N$9
  Top 0.254: R10.1 C7.1
N$10
  Top 0.254: 47.84,13.5 R11.2 48.1,13.39 48.1,14.61 47.94,14.76 46.99,14.76 46.24,15.51 VR1.3
N$11
  Top 0.406: RN2.4 21.52,7.47 ACT.A
N$12
  Top 0.406: U6.6 64.14,29.53 65.63,29.48 C9.1
N$13
  pour Top (isolate 0.305, no thermals): 67.06,29.08 72.14,29.08 72.52,29.46 72.52,30.23 72.14,30.61 67.06,30.61
N$14
  Top 0.356: U6.3 R14.1
N$15
  Top 0.406: RN2.3 20.72,5.09 MOT.A
N$16
  Top 0.406: RN1.3 7.38,5.73 RSSI.A
N$17
  cutout Bottom: 73.66,31.12 63.88,31.12 63.88,28.58 73.66,28.58
N$18
  Top 0.406: RN2.2 19.92,5.73 AQ.A
N$19
  Top 0.406: RN2.1 19.12,8.11 RX.A
N$20
  Top 0.203: R17.2 16.89,42.04 16.89,43.31 15.11,45.09 9.49,45.09 7.75,43.34 7.75,41.78 JP1.2
  Top 0.406: R16.1 R17.2
N$21
  cutout Top (isolate 0.305, rank 2): 73.66,31.12 73.66,30.73 66.8,30.73 66.8,28.96 73.66,28.96 73.66,28.58 63.88,28.58 63.88,31.12
N$23
  Top 0.203: 53.21,26.04 Q1.3
  Top 0.406: 53.21,26.04 49.91,29.34 48.44,30.81 U7.HB
N$29
  Top 0.406: RN1.4 8.19,8.11 XB_ON.A
P1.3  (via drill 0.36)
  Top 0.203: v65.41,9.27 65.41,11.05 63.88,11.05 IC9.5 | v24.51,30.86 v24.51,11.56 | v21.46,32.38 21.46,39.5 21.21,39.75 21.21,41.78 R16.2
  Bottom 0.203: v65.41,9.27 65.15,9.02 60.86,9.02 59.09,10.79 59.05,10.79 52.2,10.79 51.94,10.54 50.93,10.54 49.66,11.81 24.77,11.81 v24.51,11.56 | v24.51,30.86 22.99,32.38 v21.46,32.38
P1.4  (via drill 0.36)  (1 unrouted)
  Top 0.203: v65.15,11.81 63.88,11.81 IC9.6 | v51.43,11.81 51.43,16.89 46.35,21.97 43.69,24.64 43.56,24.77 42.29,24.77 42.29,26.04 R1.2
  Top 0.254: 51.43,32.38 47.47,32.38 44.29,29.21 44.29,25.24 43.69,24.64
  Bottom 0.203: v65.15,11.81 64.9,12.06 51.69,12.06 v51.43,11.81
P1.5  (via drill 0.36)
  Top 0.203: 57.78,27.05 57.78,33.66 58.04,33.91 59.05,33.91 C12.2 59.05,34.16 59.31,33.91 59.31,31.88 R14.2 | 63.63,12.32 IC9.7 63.63,12.32 | 63.63,12.32 62.8,12.32 v62.29,12.83 | v53.21,13.08 55.24,15.11 55.24,24 56.77,25.53 57.78,26.54 57.78,27.05 | 57.78,27.05 57.78,26.8
  Bottom 0.203: v62.29,12.83 62.36,12.57 53.72,12.57 v53.21,13.08
P1.6  (via drill 0.36)
  Top 0.203: v56.52,20.7 57.28,19.94 57.28,16.13 57.02,15.88 57.02,12.32 58.04,12.32 IC9.14 | v20.7,20.7 20.7,22.99 IC4.2
  Bottom 0.203: v20.7,20.7 v56.52,20.7
P1.7  (via drill 0.3, 0.36)
  Top 0.203: v56.52,16.38 56.52,12.11 56.81,11.81 58.04,11.81 IC9.15
  Top 0.254: U5.4 39.98,17.36 41.27,17.36 41.64,17.51 C8.2 VR1.1 46.22,17.51 46.85,17.51 VR1.2 v49.28,16.51
  Bottom 0.203: v56.52,16.38 49.4,16.38 v49.28,16.51
P2.0  (via drill 0.36)
  Top 0.203: 64.39,33.91 64.14,33.91 R12.1 64.39,33.91 | 64.39,33.91 64.39,32.64 64.14,32.38 64.14,31.88 U6.1 | v63.12,27.05 63.37,27.05 65.66,24.77 65.66,13.08 63.88,13.08 IC9.8 | v65.15,31.37 65.15,33.66 64.9,33.91 64.39,33.91
  Bottom 0.203: v63.12,27.05 63.12,28.07 62.61,28.58 62.61,28.83 v65.15,31.37
P2.1  (via drill 0.36)
  Top 0.203: v22.23,10.29 21.72,9.78 RN2.5 | v61.53,13.59 63.63,13.59 IC9.9
  Bottom 0.203: v22.23,10.29 22.48,10.03 25.02,10.03 26.29,11.3 48.64,11.3 52.2,7.75 65.91,7.75 67.69,9.53 67.69,11.05 66.17,12.57 63.88,12.57 62.86,13.59 v61.53,13.59
P2.2  (via drill 0.36)
  Top 0.203: v20.7,11.56 20.7,9.78 RN2.6 | v22.48,14.61 v22.48,11.56 | v61.85,15.88 61.85,14.61 62.1,14.35 63.63,14.35 IC9.10
  Bottom 0.203: v22.48,11.56 v20.7,11.56 | v22.48,14.61 22.73,14.35 56.01,14.35 57.53,15.88 v61.85,15.88
P2.3  (via drill 0.36)
  Top 0.203: v57.78,15.11 57.78,14.35 58.04,14.35 IC9.11 | v21.46,14.1 21.46,13.33 19.94,11.81 19.94,9.78 RN2.7 | 52.45,23.75 Q1.1 | 52.45,19.18 R3.2 52.45,18.92 v52.45,17.15
  Top 0.406: 52.45,19.18 52.45,23.75
  Bottom 0.203: v21.46,14.1 21.72,13.84 56.52,13.84 v57.78,15.11 57.78,15.37 61.34,15.37 61.59,15.11 62.61,15.11 62.61,16.13 62.1,16.64 61.59,16.64 61.34,16.38 57.53,16.38 56.77,17.15 56.26,17.15 56.01,16.89 52.7,16.89 v52.45,17.15
RSSI
  Top 0.203: RN1.6 7.49,9.78 7.49,10.03 10.79,13.33 11.92,14.46 XB2.6
TEST  (via drill 0.36)
  Top 0.203: JP2.2 70.99,16.64 69.22,16.64 JP3.2 69.22,16.38 69.22,15.88 67.69,15.88 66.68,14.86 66.68,11.05 v66.93,10.79 | v61.28,10.54 58.29,10.54 IC9.17
  Bottom 0.203: v61.28,10.54 61.53,10.79 v66.93,10.79
VCC
  Top 0.254: U5.5 37.46,17.36 37.46,17.15 35.56,17.15 R8.2
  pour Top (isolate 0.254, no thermals): 37.85,19.94 37.85,16.76 33.27,16.76 33.27,18.59 34.62,19.94
XB_ASSOC
  Top 0.203: RN1.7 6.58,11.82 8.89,14.13 8.89,31.12 11.91,34.13 11.91,37.02 XB2.15
XB_DIN  (via drill 0.3, 0.36)
  Top 0.203: v60.83,5.97 60.83,6.98 61.34,7.49 61.34,8.76 63.12,10.54 63.63,10.54 IC9.4 | v33.66,8.26 33.66,12.32 33.15,12.83 33.15,13.08 v32.89,13.08 | RN1.8 5.71,9.78 5.71,12.57 5.97,12.83 5.97,14.86 XB2.3
  Bottom 0.203: v60.83,5.97 60.58,6.22 51.43,6.22 49.15,8.51 33.91,8.51 v33.66,8.26 | v32.89,13.08 32.64,13.33 22.48,13.33 20.7,13.33 7.24,13.33 5.97,14.61 5.97,14.86 XB2.3
XB_DOUT  (via drill 0.3)
  Top 0.203: 18.92,9.78 RN2.8 19.18,9.78 v19.18,10.54 | v61.85,6.98 61.85,8.51 63.12,9.78 63.63,9.78 IC9.3
  Bottom 0.203: v61.85,6.98 61.59,7.24 51.94,7.24 49.66,9.53 20.19,9.53 v19.18,10.54 18.67,11.05 6.48,11.05 4.45,13.08 4.45,13.33 3.94,13.84 3.94,14.86 XB2.2
XBEE_ON  (via drill 0.3, 0.36)
  Top 0.203: v9.27,9.27 9.02,9.53 8.26,9.53 RN1.5 | v59.63,13.33 59.37,13.08 58.29,13.08 IC9.13 | v16.89,9.53 16.89,15.62 15.88,16.64 15.88,36.96 XB2.13
  Bottom 0.203: v59.63,13.33 60.39,14.1 60.64,14.35 62.86,14.35 64.14,13.08 66.42,13.08 68.2,11.3 68.2,9.27 66.17,7.24 63.12,7.24 62.1,6.22 61.59,6.22 61.09,6.73 51.69,6.73 49.4,9.02 18.92,9.02 18.42,9.53 18.16,9.53 17.91,9.78 16.89,9.78 | 16.89,9.78 9.78,9.78 v9.27,9.27 | 16.89,9.78 v16.89,9.53

### Text on the board
tPlace: GND | MAT | +5V | kippkitts, llc
tNames: GND | BAT+ | GND | 1 | RST | TEST | 3V
Document: CERN Open Hardware Licence v1.2
Reference: These holes are / intentionally off / board